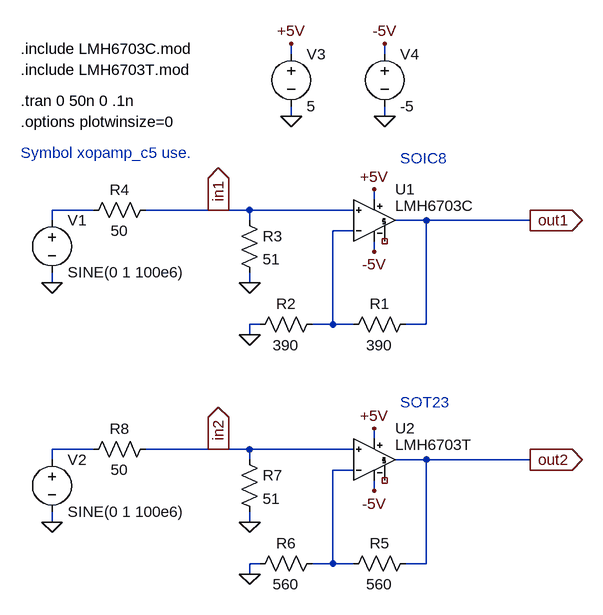
[diagram p0: schematic LMH6703_test.asc]
LMH6703_test.asc, the LTspice schematic file:
Version 4
SHEET 1 880 704
WIRE 96 -128 96 -144
WIRE 240 -128 240 -144
WIRE 96 -32 96 -48
WIRE 240 -32 240 -48
WIRE 224 96 224 80
WIRE -208 112 -272 112
WIRE -16 112 -128 112
WIRE 32 112 -16 112
WIRE 192 112 32 112
WIRE -272 128 -272 112
WIRE 32 128 32 112
WIRE 304 128 256 128
WIRE 464 128 304 128
WIRE 192 144 160 144
WIRE 224 176 224 160
WIRE -272 224 -272 208
WIRE 32 224 32 208
WIRE 48 288 32 288
WIRE 160 288 160 144
WIRE 160 288 128 288
WIRE 192 288 160 288
WIRE 304 288 304 128
WIRE 304 288 272 288
WIRE 32 304 32 288
WIRE 224 464 224 448
WIRE -208 480 -272 480
WIRE -16 480 -128 480
WIRE 32 480 -16 480
WIRE 192 480 32 480
WIRE -272 496 -272 480
WIRE 32 496 32 480
WIRE 304 496 256 496
WIRE 464 496 304 496
WIRE 192 512 160 512
WIRE 224 544 224 528
WIRE -272 592 -272 576
WIRE 32 592 32 576
WIRE 48 656 32 656
WIRE 160 656 160 512
WIRE 160 656 128 656
WIRE 192 656 160 656
WIRE 304 656 304 496
WIRE 304 656 272 656
WIRE 32 672 32 656
FLAG 224 80 +5V
FLAG 224 176 -5V
FLAG 32 304 0
FLAG 32 224 0
FLAG -272 224 0
FLAG 464 128 out1
IOPIN 464 128 Out
FLAG -16 112 in1
IOPIN -16 112 Out
FLAG 224 448 +5V
FLAG 224 544 -5V
FLAG 32 672 0
FLAG 32 592 0
FLAG -272 592 0
FLAG 464 496 out2
IOPIN 464 496 Out
FLAG -16 480 in2
IOPIN -16 480 Out
FLAG 240 -32 0
FLAG 96 -32 0
FLAG 96 -144 +5V
FLAG 240 -144 -5V
SYMBOL res 176 304 R270
WINDOW 0 32 56 VTop 0
WINDOW 3 0 56 VBottom 0
SYMATTR InstName R1
SYMATTR Value 390
SYMBOL res 32 304 R270
WINDOW 0 32 56 VTop 0
WINDOW 3 0 56 VBottom 0
SYMATTR InstName R2
SYMATTR Value 390
SYMBOL res 16 112 R0
SYMATTR InstName R3
SYMATTR Value 51
SYMBOL voltage -272 112 R0
WINDOW 123 0 0 Left 0
WINDOW 39 0 0 Left 0
SYMATTR InstName V1
SYMATTR Value SINE(0 1 100e6)
SYMBOL xopamp_c5 224 64 R0
SYMATTR InstName U1
SYMATTR Value LMH6703C
SYMBOL res -224 128 R270
WINDOW 0 32 56 VTop 0
WINDOW 3 0 56 VBottom 0
SYMATTR InstName R4
SYMATTR Value 50
SYMBOL res 176 672 R270
WINDOW 0 32 56 VTop 0
WINDOW 3 0 56 VBottom 0
SYMATTR InstName R5
SYMATTR Value 560
SYMBOL res 32 672 R270
WINDOW 0 32 56 VTop 0
WINDOW 3 0 56 VBottom 0
SYMATTR InstName R6
SYMATTR Value 560
SYMBOL res 16 480 R0
SYMATTR InstName R7
SYMATTR Value 51
SYMBOL voltage -272 480 R0
WINDOW 123 0 0 Left 0
WINDOW 39 0 0 Left 0
SYMATTR InstName V2
SYMATTR Value SINE(0 1 100e6)
SYMBOL xopamp_c5 224 432 R0
SYMATTR InstName U2
SYMATTR Value LMH6703T
SYMBOL res -224 496 R270
WINDOW 0 32 56 VTop 0
WINDOW 3 0 56 VBottom 0
SYMATTR InstName R8
SYMATTR Value 50
SYMBOL voltage 96 -144 R0
SYMATTR InstName V3
SYMATTR Value 5
SYMBOL voltage 240 -144 R0
SYMATTR InstName V4
SYMATTR Value -5
TEXT -320 -136 Left 0 !.include LMH6703C.mod
TEXT -320 -56 Left 0 !.tran 0 50n 0 .1n
TEXT -320 -24 Left 0 !.options plotwinsize=0
TEXT 264 32 Left 0 ;SOIC8
TEXT 264 408 Left 0 ;SOT23
TEXT -320 -104 Left 0 !.include LMH6703T.mod
TEXT -320 24 Left 0 ;Symbol xopamp_c5 use.

The netlist it stands for:
* LMH6703_test.asc
R1 N002 out1 390
R2 0 N002 390
R3 in1 0 51
V1 N001 0 SINE(0 1 100e6)
XU1 in1 N002 +5V -5V out1 NC_01 LMH6703C  ; pins In+ In- V+ V- OUT COMP
R4 N001 in1 50
R5 N004 out2 560
R6 0 N004 560
R7 in2 0 51
V2 N003 0 SINE(0 1 100e6)
XU2 in2 N004 +5V -5V out2 NC_02 LMH6703T  ; pins In+ In- V+ V- OUT COMP
R8 N003 in2 50
V3 +5V 0 5
V4 -5V 0 -5
.include LMH6703C.mod
.tran 0 50n 0 .1n
.options plotwinsize=0
* SOIC8
* SOT23
.include LMH6703T.mod
* Symbol xopamp_c5 use.
.backanno
.end